# EAGLE design servusb (EAGLE 7.1.0)
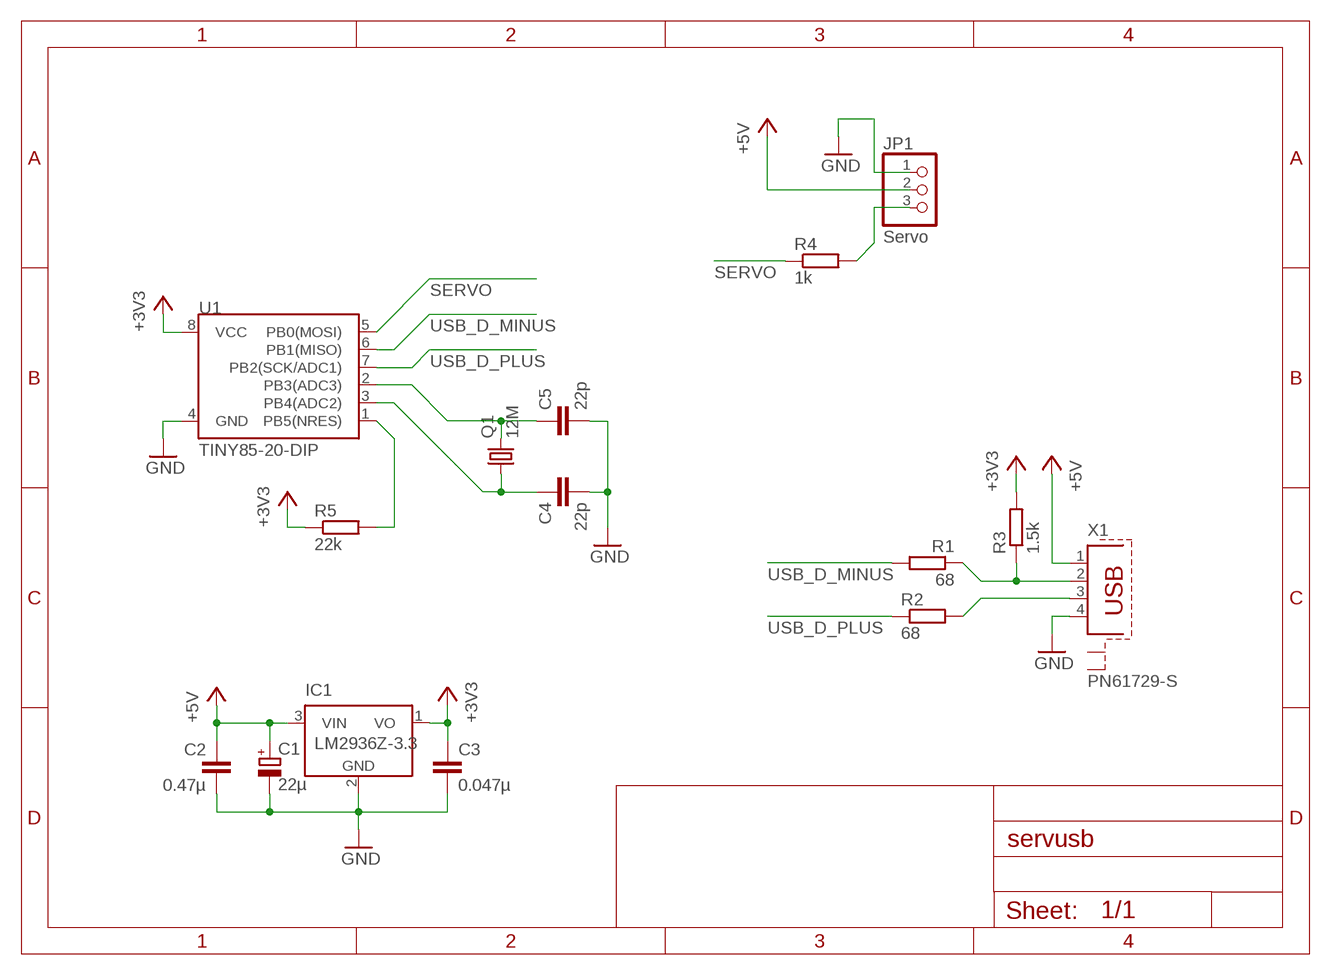
[diagram p0: schematic, sheet 1]

## Parts
C1  22µ  CPOL-EUE2.5-6  [E2,5-6]
C2  0.47µ  C-EU075-042X103  [C075-042X103]
C3  0.047µ  C-EU050-025X075  [C050-025X075]
C4  22p  C-EU025-024X044  [C025-024X044]
C5  22p  C-EU025-024X044  [C025-024X044]
IC1  LM2936Z-3.3  [TO92]
JP1  Servo  PINHD-1X3  [1X03]
Q1  12M  CRYSTALHC49S  [HC49/S]
R1  68  R-EU_0204/7  [0204/7]
R2  68  R-EU_0204/7  [0204/7]
R3  1.5k  R-EU_0204/7  [0204/7]
R4  1k  R-EU_0204/7  [0204/7]
R5  22k  R-EU_0204/7  [0204/7]
U1  TINY85-20-DIP  ATTINY45TINY85-20-DIP  [DIP08]
X1  PN61729-S  [PN61729-S]

## Nets
+3V3: C3.1 IC1.1(VO) R3.2 R5.1 U1.8(VCC)
+5V: C1.+ C2.1 IC1.3(VIN) JP1.2 X1.1
GND: C1.- C2.2 C3.2 C4.2 C5.2 IC1.2(GND) JP1.1 U1.4(GND) X1.4
N$1: C5.1 Q1.2 U1.2(PB3(ADC3))
N$2: C4.1 Q1.1 U1.3(PB4(ADC2))
N$4: R5.2 U1.1(PB5(NRES))
N$6: R1.1 R3.1 X1.2
N$7: R2.2 X1.3
N$8: JP1.3 R4.2
SERVO: R4.1 U1.5(PB0(MOSI))
USB_D_MINUS: R1.2 U1.6(PB1(MISO))
USB_D_PLUS: R2.1 U1.7(PB2(SCK/ADC1))
Unconnected: X1.S1 X1.S2

## Library data of the parts
C1 = rcl:CPOL-EU: POLARIZED CAPACITOR, European symbol
C2-C5 = rcl:C-EU: CAPACITOR, European symbol
IC1 = national-semiconductor:LM2936?*: Ultra-Low Quiescent Current LDO Voltage Regulator Source: Data sheet <http://www.national.com/ds/LM/LM2936.pdf>; MF: NATIONAL SEMICONDUCTOR; MPN: LM2936Z-3.3/NOPB; OC_FARNELL: 1564641; OC_NEWARK: 41K4532
JP1 = pinhead:PINHD-1X3: PIN HEADER
Q1 = crystal:CRYSTAL: CRYSTAL; OC_FARNELL: 1667008; OC_NEWARK: unknown
R1-R5 = rcl:R-EU_: RESISTOR, European symbol
U1 = SparkFun-DigitalIC:ATTINY45: Atmel 8-pin 2/4/8kB flash uC; PROD_ID: IC-09445
X1 = con-berg:PN61729-S: BERG USB connector; OC_FARNELL: unknown; OC_NEWARK: unknown

## Board
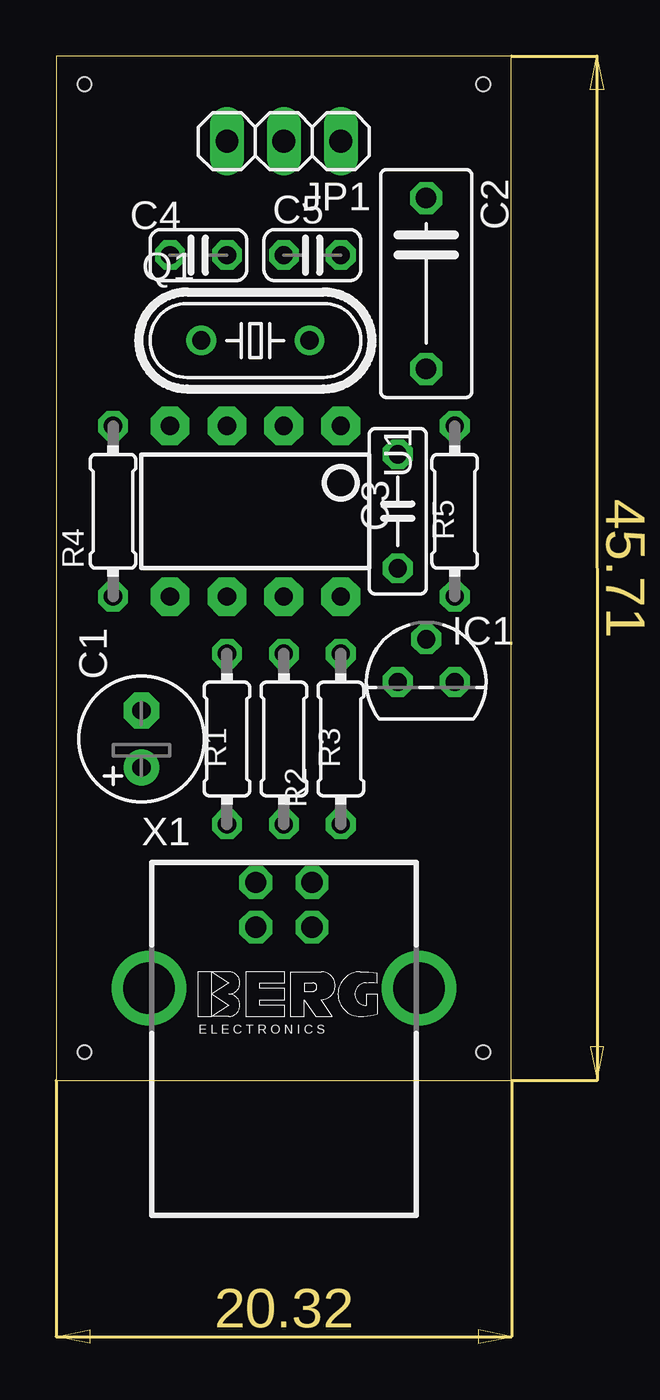
[diagram p1: board, top side]
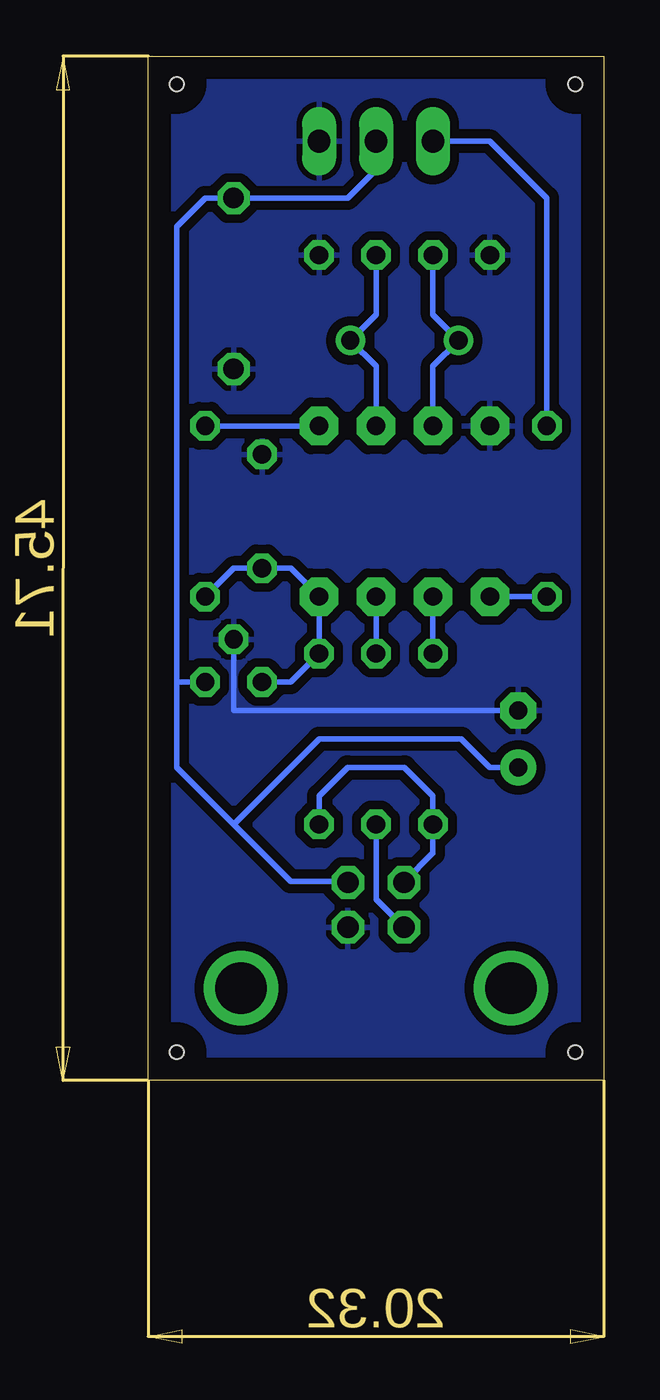
[diagram p2: board, bottom side, seen from below]

Size 20.31 x 45.71 mm. Coordinates in mm from the lower left corner, seen from the top.
Outline: 0,0 20.31,0 20.31,45.71 0,45.71 0,0
Copper layers (1*16): Top 0.035mm / dielectric 1.5mm / Bottom 0.035mm
Design rules "default": minimum track width 10mil, minimum drill 24mil, track to track 8mil, track to pad 8mil, pad to pad 8mil, via to via 8mil, smd to smd 8mil, copper to edge 40mil, drill to drill 8mil, minimum pad ring 10mil, minimum via ring 8mil, stop-mask expansion 4mil, vias tented up to drill 0mil, thermal gap 10mil
Holes 0.6 mm at 1.27,44.45 1.27,1.27 19.05,1.27 19.05,44.45

### Footprints (pad centres in the part's own frame; a part is rotated, then mirrored left to right if it is on the bottom)
E2,5-6 = drill 0.813 pad 1.6: + -1.27,0 | drill 0.813 pad 1.6 octagon: - 1.27,0
C075-042X103 = drill 0.914 octagon: 1 -3.81,0; 2 3.81,0
C050-025X075 = drill 0.813 octagon: 1 -2.54,0; 2 2.54,0
C025-024X044 = drill 0.813 octagon: 1 -1.27,0; 2 1.27,0
TO92 = drill 0.813 pad 1.27 octagon: 1 -1.27,0; 2 0,1.905; 3 1.27,0
1X03 = drill 1.016 long: 1 -2.54,0; 2 0,0; 3 2.54,0
HC49/S = drill 0.813: 1 -2.413,0; 2 2.413,0
0204/7 = drill 0.813 octagon: 1 -3.81,0; 2 3.81,0
DIP08 = drill 0.813 pad 1.727 octagon: 1 -3.81,-3.81; 2 -1.27,-3.81; 3 1.27,-3.81; 4 3.81,-3.81; 5 3.81,3.81; 6 1.27,3.81; 7 -1.27,3.81; 8 -3.81,3.81
PN61729-S = drill 0.95 octagon: 1 1.25,4.71; 2 -1.25,4.71; 3 -1.25,2.71; 4 1.25,2.71 | drill 2.3 pad 2.9: S1 -6.02,0; S2 6.02,0

### Placement (x,y rotation side)
C1  3.81,15.24 90 top
C2  16.51,35.56 270 top
C3  15.24,25.4 90 top
C4  6.35,36.83 180 top
C5  11.43,36.83 0 top
IC1  16.51,17.78 0 top
JP1  10.16,41.91 180 top
Q1  8.89,33.02 0 top
R1  7.62,15.24 90 top
R2  10.16,15.24 270 top
R3  12.7,15.24 90 top
R4  2.54,25.4 90 top
R5  17.78,25.4 90 top
U1  8.89,25.4 180 top
X1  10.16,4.13 0 top

### Tracks (layer width: path | path; a pad name or v marks a point on that pad's centre or on a via)
+3V3
  Bottom 0.254: R5.1 16.51,22.86 C3.1 13.97,22.86 U1.8 R3.2 13.97,17.78 IC1.1
+5V
  Bottom 0.254: X1.1 11.46,8.89 13.97,8.89 16.51,11.43 | 19.05,17.78 19.05,38.1 17.78,39.37 C2.1 11.43,39.37 10.16,40.64 JP1.2 | 19.05,17.78 19.05,13.97 16.51,11.43 | IC1.3 19.05,17.78 | C1.+ 5.08,13.97 6.35,15.24 12.7,15.24 16.51,11.43
GND
  Bottom 0.254: IC1.2 16.51,16.51 C1.-
  pour Bottom (isolate 0.406): -1.27,46.99 -1.27,-1.27 21.59,-1.27 21.59,46.99
N$1
  Bottom 0.254: U1.2 10.16,31.88 Q1.2 10.16,34.16 C5.1
N$2
  Bottom 0.254: U1.3 7.62,31.88 Q1.1 7.62,34.16 C4.1
N$4
  Bottom 0.254: R5.2 U1.1
N$6
  Bottom 0.254: 7.62,10.13 7.62,10.16 | 7.62,10.16 R1.1 7.62,12.7 8.89,13.97 11.43,13.97 12.7,12.7 R3.1 | X1.2 8.91,8.87 7.62,10.16
N$7
  Bottom 0.254: X1.3 10.16,8.09 R2.2
N$8
  Bottom 0.254: R4.2 2.54,39.37 5.08,41.91 JP1.3
SERVO
  Bottom 0.254: R4.1 U1.5
USB_D_MINUS
  Bottom 0.254: U1.6 R1.2
USB_D_PLUS
  Bottom 0.254: U1.7 R2.1